# EAGLE design HD PCB Fully Integrated (EAGLE 9.6.2)
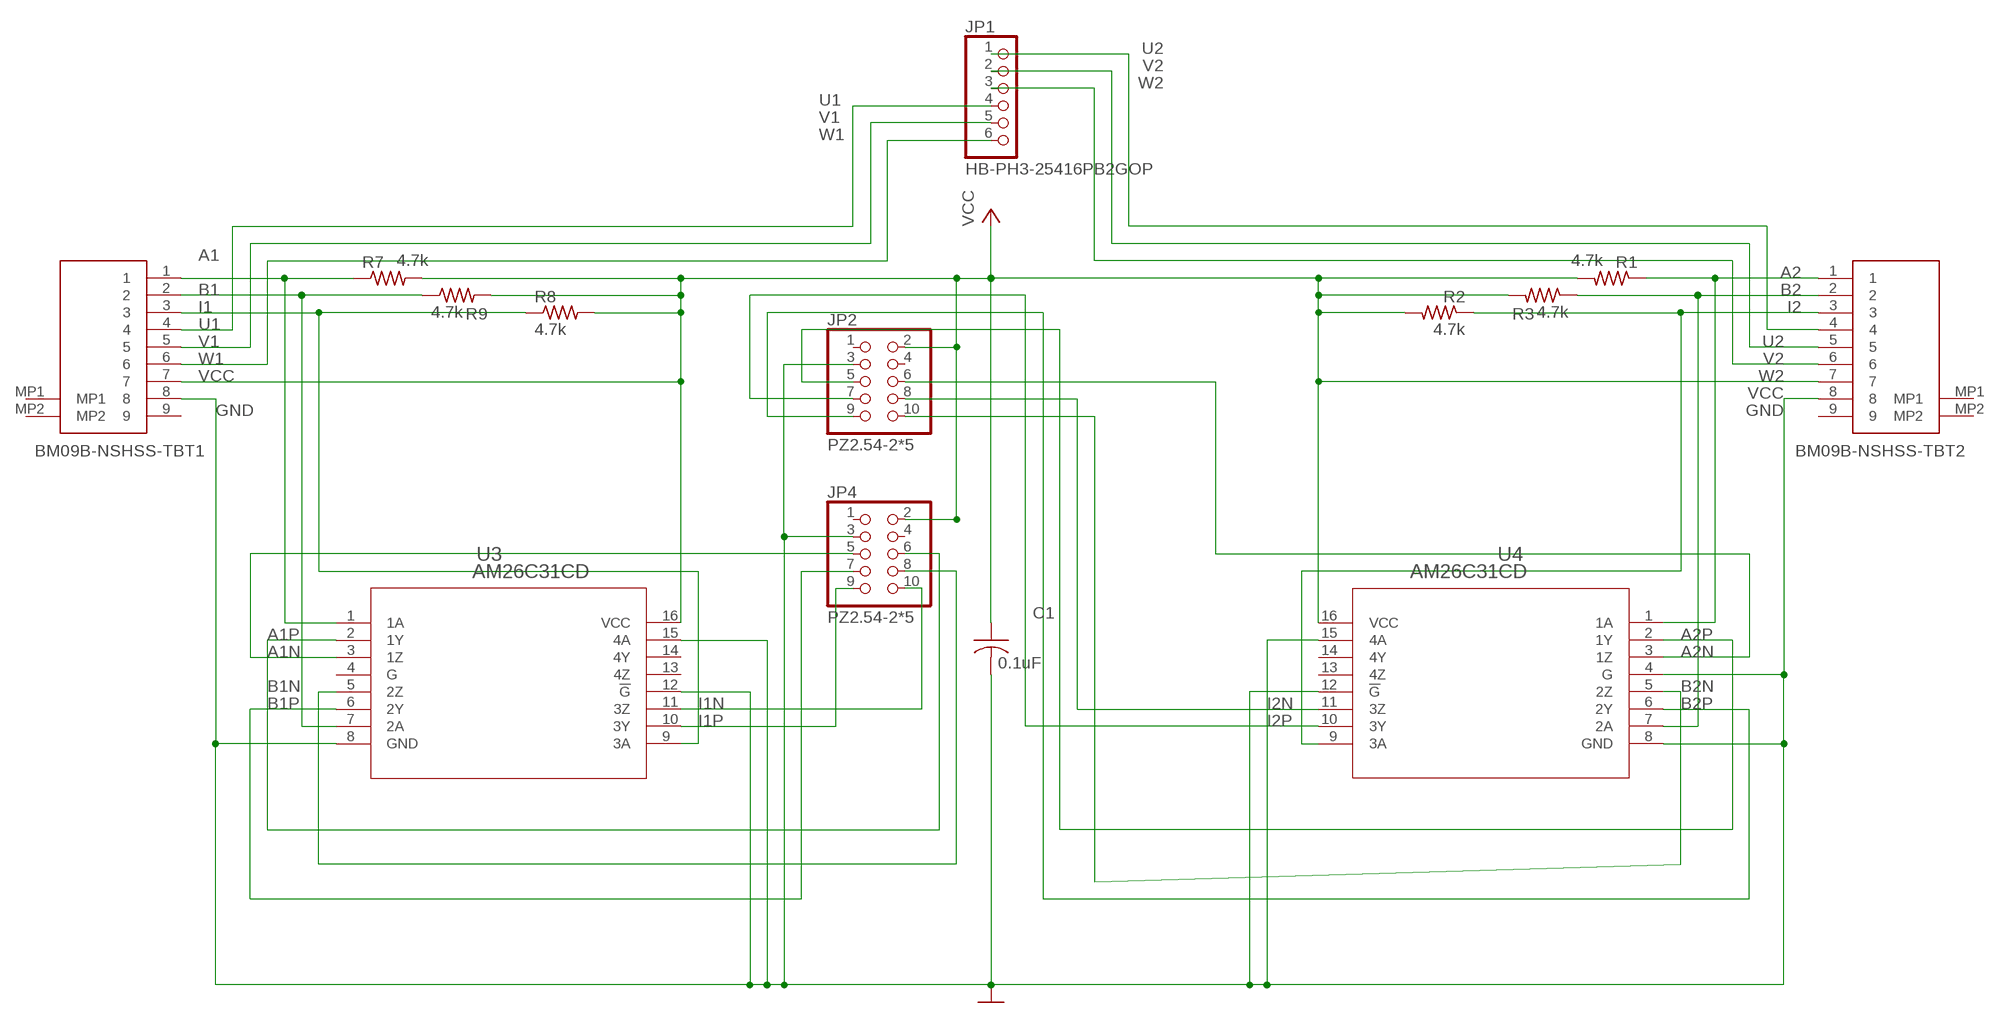
[diagram p0: schematic, sheet 1]

## Parts
BM09B-NSHSS-TBT1  BM09B-NSHSS-TBT_LF__SN_  [BM09BNSHSSTBTLFSN]
BM09B-NSHSS-TBT2  BM09B-NSHSS-TBT_LF__SN_  [BM09BNSHSSTBTLFSN]
C1  0.1uF  C-USC0805  [C0805]
JP1  HB-PH3-25416PB2GOP  PINHD-1X6  [1X06]
JP2  PZ2.54-2*5  PINHD-2X5  [2X05]
JP4  PZ2.54-2*5  PINHD-2X5  [2X05]
R1  4.7k  R-US_R0805  [R0805]
R2  4.7k  R-US_R0805  [R0805]
R3  4.7k  R-US_R0805  [R0805]
R7  4.7k  R-US_R0805  [R0805]
R8  4.7k  R-US_R0805  [R0805]
R9  4.7k  R-US_R0805  [R0805]
U3  AM26C31CD  [D16]
U4  AM26C31CD  [D16]

## Nets
A1: BM09B-NSHSS-TBT1.1 R7.1 U3.1(1A)
A1N: JP4.5 U3.3(1Z)
A1P: JP4.6 U3.2(1Y)
A2: BM09B-NSHSS-TBT2.1 R1.1 U4.1(1A)
A2N: JP2.6 U4.3(1Z)
A2P: JP2.5 U4.2(1Y)
B1: BM09B-NSHSS-TBT1.2 R9.1 U3.7(2A)
B1N: JP4.8 U3.5(2Z)
B1P: JP4.7 U3.6(2Y)
B2: BM09B-NSHSS-TBT2.2 R3.1 U4.7(2A)
B2N: JP2.10 U4.5(2Z)
B2P: JP2.9 U4.6(2Y)
GND: BM09B-NSHSS-TBT1.8 BM09B-NSHSS-TBT2.8 C1.2 JP2.3 JP4.3 U3.8(GND) U3.12(!G) U3.15(4A) U4.4(G) U4.8(GND) U4.12(!G) U4.15(4A)
I1: BM09B-NSHSS-TBT1.3 R8.1 U3.9(3A)
I1N: JP4.10 U3.11(3Z)
I1P: JP4.9 U3.10(3Y)
I2: BM09B-NSHSS-TBT2.3 R2.1 U4.9(3A)
I2N: JP2.8 U4.11(3Z)
I2P: JP2.7 U4.10(3Y)
U1: BM09B-NSHSS-TBT1.4 JP1.4
U2: BM09B-NSHSS-TBT2.4 JP1.1
V1: BM09B-NSHSS-TBT1.5 JP1.5
V2: BM09B-NSHSS-TBT2.5 JP1.2
VCC: BM09B-NSHSS-TBT1.7 BM09B-NSHSS-TBT2.7 C1.1 JP2.2 JP4.2 R1.2 R2.2 R3.2 R7.2 R8.2 R9.2 U3.16(VCC) U4.16(VCC)
W1: BM09B-NSHSS-TBT1.6 JP1.6
W2: BM09B-NSHSS-TBT2.6 JP1.3
Unconnected: BM09B-NSHSS-TBT1.9 BM09B-NSHSS-TBT1.MP1 BM09B-NSHSS-TBT1.MP2 BM09B-NSHSS-TBT2.9 BM09B-NSHSS-TBT2.MP1 BM09B-NSHSS-TBT2.MP2 JP2.1 JP2.4 JP4.1 JP4.4 U3.4(G) U3.13(4Z) U3.14(4Y) U4.13(4Z) U4.14(4Y)

## Library data of the parts
BM09B-NSHSS-TBT1 BM09B-NSHSS-TBT2 = BM09B-NSHSS-TBT_LF__SN_:BM09B-NSHSS-TBT_LF__SN_: CONN HEADER SMD 9POS 1MM Source: Datasheet <http://www.jst-mfg.com/product/pdf/eng/eNSH.pdf>; DESCRIPTION: CONN HEADER SMD 9POS 1MM; HEIGHT: 6mm; MANUFACTURER_NAME: JST (JAPAN SOLDERLESS TERMINALS); MANUFACTURER_PART_NUMBER: BM09B-NSHSS-TBT(LF)(SN)
C1 = rcl:C-US: CAPACITOR, American symbol; SPICEPREFIX: C
JP1 = pinhead:PINHD-1X6: PIN HEADER
JP2 JP4 = pinhead:PINHD-2X5: PIN HEADER
R1-R3 R7-R9 = rcl:R-US_: RESISTOR, American symbol; MF: VISHAY; MPN: CRCW04024K70FKED; OC_NEWARK: 42K3486; SPICEPREFIX: R
U3 U4 = AM26C31CD:AM26C31CD; COPYRIGHT: Copyright (C) 2023 Ultra Librarian. All rights reserved.; MANUFACTURER_PART_NUMBER: AM26C31CD; MFR_NAME: Texas Instruments

## Module HDPINOUT
Ports: GND(io) I(io) A(io) +5V(io) B(io)

### Library data of the parts

## Board
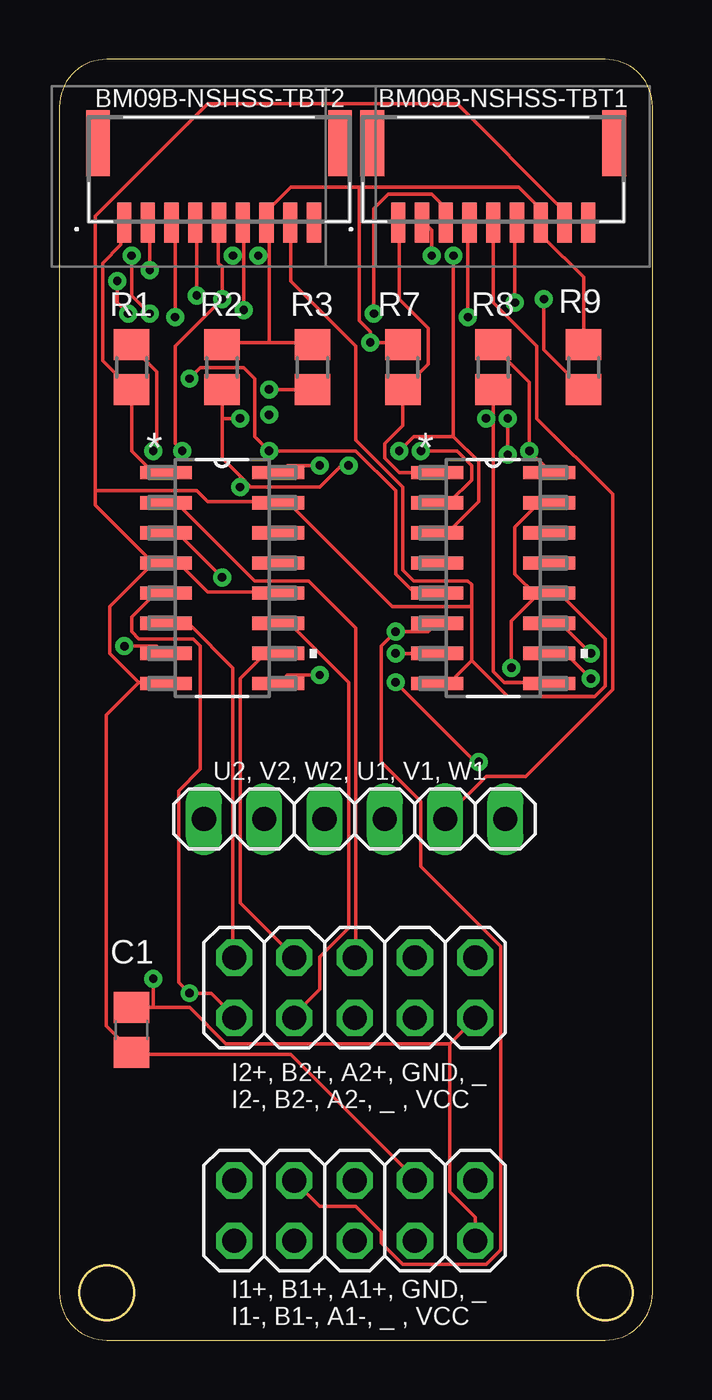
[diagram p1: board, top side]
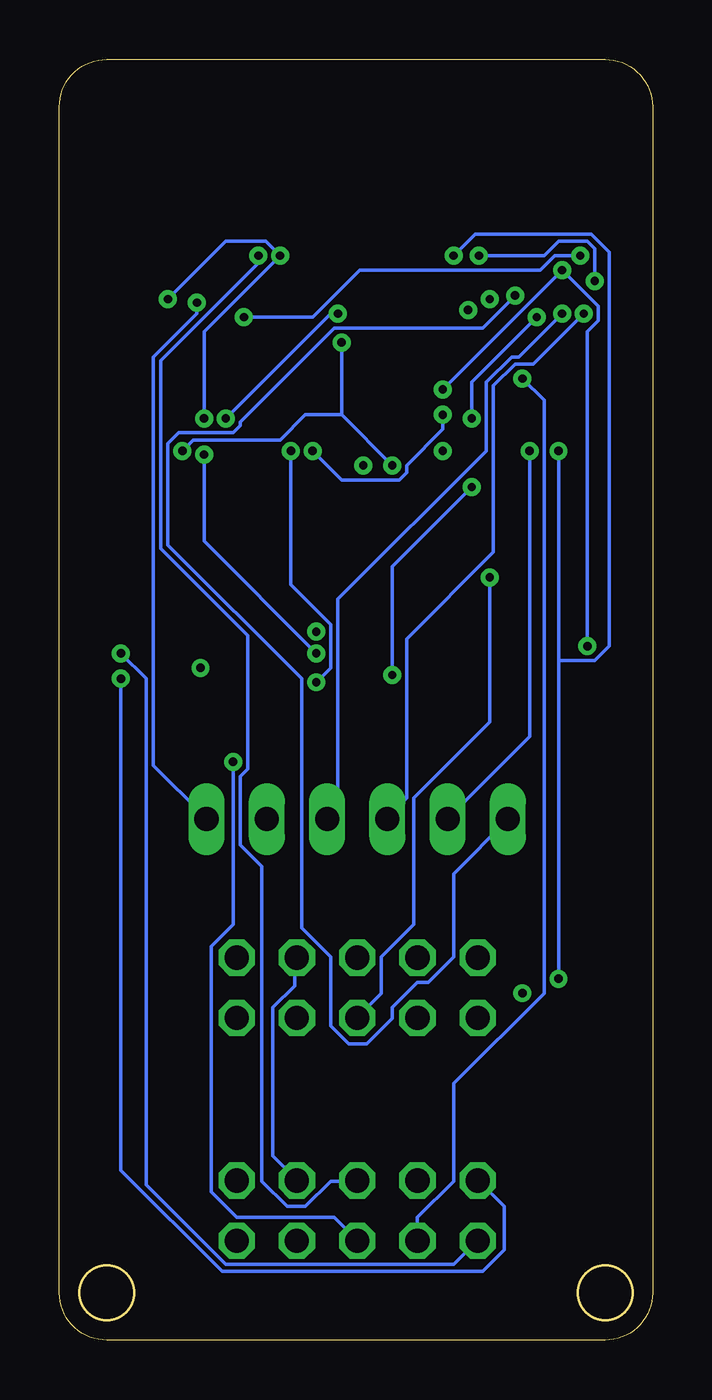
[diagram p2: board, bottom side, seen from below]

Size 25 x 54 mm. Coordinates in mm from the lower left corner, seen from the top.
Outline: 0,52 0,2 arc90 2,0 23,0 23.17,0.01 arc85 25,2 25,52 24.99,52.17 arc85 23,54 2,54 1.83,53.99 arc85 0,52
Outline: circle at 23,2 radius 1.15
Outline: circle at 2,2 radius 1.15
Copper layers (1*16): Top 0.035mm / dielectric 1.5mm / Bottom 0.035mm
Design rules "default": minimum track width 6mil, minimum drill 0.35mm, track to track 6mil, track to pad 6mil, pad to pad 6mil, via to via 6mil, smd to smd 6mil, copper to edge 40mil, drill to drill 6mil, minimum pad ring 10mil, minimum via ring 8mil, stop-mask expansion 4mil, vias tented up to drill 0mil, thermal gap 10mil

### Footprints (pad centres in the part's own frame; a part is rotated, then mirrored left to right if it is on the bottom)
BM09BNSHSSTBTLFSN = smd 0.6 x 1.7: 1 4,4.45; 2 3,4.45; 3 2,4.45; 4 1,4.45; 5 0,4.45; 6 -1,4.45; 7 -2,4.45; 8 -3,4.45; 9 -4,4.45 | smd 1 x 2.8: MP1 5.1,1.1; MP2 -5.1,1.1
C0805 = smd 1.3 x 1.5: 1 -0.95,0; 2 0.95,0
1X06 = drill 1.016 long: 1 -6.35,0; 2 -3.81,0; 3 -1.27,0; 4 1.27,0; 5 3.81,0; 6 6.35,0
2X05 = drill 1.016 octagon: 1 -5.08,-1.27; 2 -5.08,1.27; 3 -2.54,-1.27; 4 -2.54,1.27; 5 0,-1.27; 6 0,1.27; 7 2.54,-1.27; 8 2.54,1.27; 9 5.08,-1.27; 10 5.08,1.27
R0805 = smd 1.3 x 1.5: 1 -0.95,0; 2 0.95,0
D16 = smd 2.184 x 0.559: 1 -2.362,4.445; 2 -2.362,3.175; 3 -2.362,1.905; 4 -2.362,0.635; 5 -2.362,-0.635; 6 -2.362,-1.905; 7 -2.362,-3.175; 8 -2.362,-4.445; 9 2.362,-4.445; 10 2.362,-3.175; 11 2.362,-1.905; 12 2.362,-0.635; 13 2.362,0.635; 14 2.362,1.905; 15 2.362,3.175; 16 2.362,4.445

### Placement (x,y rotation side)
BM09B-NSHSS-TBT1  18.29,51.56 180 top
BM09B-NSHSS-TBT2  6.73,51.56 180 top
C1  3.05,13.08 270 top
JP1  12.45,21.97 0 top
JP2  12.45,14.86 180 top
JP4  12.45,5.46 180 top
R1  3.05,41.02 90 top
R2  6.86,41.02 90 top
R3  10.67,41.02 90 top
R7  14.48,41.02 90 top
R8  18.29,41.02 90 top
R9  22.1,41.02 90 top
U3  18.29,32.13 0 top
U4  6.86,32.13 0 top

### Tracks (layer width: path | path; a pad name or v marks a point on that pad's centre or on a via)
A1
  Top 0.152: U3.1 14.33,36.58 13.72,37.19 13.72,37.8 14.48,38.56 R7.1 14.48,40.08 15.54,41.15 15.54,42.67 14.33,43.89 14.33,47.09 BM09B-NSHSS-TBT1.1
A1N  (via drill 0.35)
  Top 0.152: v14.33,37.49 14.94,38.1 16.61,38.1 | 16.61,38.1 17.68,37.03 17.68,35.36 16.46,34.14 16,34.14 U3.3 | 16.61,38.1 v16.61,45.72
  Bottom 0.152: v8.84,39.01 8.84,38.41 10.36,36.88 10.36,36.58 10.67,36.27 13.11,36.27 v14.33,37.49 | v16.61,45.72 16.61,45.41 20.73,41.3 20.73,33.38 17.07,29.72 17.07,24.08 17.37,23.77 17.37,20.88 16.46,19.96 16.46,6.71 15.39,5.64 14.63,5.64 13.56,6.71 12.5,6.71 JP4.5
A1P  (via drill 0.35)
  Top 0.152: v15.24,37.49 16.76,37.49 17.37,36.88 17.37,36.27 16.46,35.36 16,35.36 U3.2 | v14.17,27.74 17.53,24.38 v17.68,24.38
  Bottom 0.152: v17.68,24.38 17.68,17.53 18.59,16.61 18.59,6.25 17.53,5.18 13.41,5.18 12.5,4.27 JP4.6 | v15.24,37.49 15.24,31.85 13.56,30.18 13.56,28.35 v14.17,27.74
A2
  Top 0.152: U4.1 3.96,36.58 3.05,37.49 R1.1 3.05,40.08 1.83,41.3 1.83,45.41 2.59,46.18 2.59,47.09 BM09B-NSHSS-TBT2.1
A2N  (via drill 0.35)
  Top 0.152: v6.86,32.16 5.03,33.98 4.57,33.98 U4.3
  Bottom 0.152: v6.86,32.16 6.86,26.06 10.06,22.86 10.06,17.53 11.43,16.15 11.43,14.63 12.34,13.72 JP2.6
A2P
  Top 0.152: U4.2 4.57,35.2 5.03,35.2 8.23,32 10.52,32 12.5,30.02 12.5,16.15 JP2.5
B1  (via drill 0.35)
  Top 0.152: v15.7,45.72 15.7,46.79 15.39,47.09 BM09B-NSHSS-TBT1.2 | v20.42,43.89 20.42,41.76 22.1,40.08 R9.1 | v14.17,28.96 U3.7 | v18.9,38.86 v18.9,37.34
  Bottom 0.152: v20.42,43.89 17.98,46.33 16.31,46.33 v15.7,45.72 18.9,42.52 v18.9,38.86 | v14.17,28.96 18.9,33.68 v18.9,37.34
B1N  (via drill 0.35)
  Top 0.152: U3.5 15.85,31.55 14.94,31.55 14.17,32.31 14.17,35.81 12.5,37.49 v8.84,37.49 8.23,38.1 8.23,40.54 7.77,41 5.94,41 v5.49,40.54
  Bottom 0.152: JP4.8 9.91,5.18 8.38,6.71 8.38,10.82 4.57,14.63 4.57,39.62 v5.49,40.54
B1P  (via drill 0.35)
  Top 0.152: U3.6 15.85,30.18 15.54,29.87 v14.17,29.87 13.56,29.26 13.56,24.38 15.24,22.71 15.24,19.96 18.59,16.61 18.59,3.81 17.98,3.2 14.48,3.2 13.56,4.12 13.56,4.57 12.5,5.64 10.97,5.64 9.91,6.71 JP4.7
B2  (via drill 0.35)
  Top 0.152: v2.74,29.26 4.12,29.26 4.42,28.96 U4.7 | v8.84,40.08 10.67,40.08 R3.1 | v3.81,45.11 3.81,47.09 BM09B-NSHSS-TBT2.2
  Bottom 0.152: v8.84,40.08 v3.81,45.11 2.29,43.59 2.29,42.98 2.74,42.52 v2.74,29.26
B2N  (via drill 0.35)
  Top 0.152: JP2.10 7.32,13.72 6.4,14.63 v5.49,14.63 5.03,15.09 5.03,23.16 5.94,24.08 5.94,29.26 5.64,29.57 3.35,29.57 3.05,29.87 3.05,30.48 3.96,31.39 4.42,31.39 U4.5
B2P
  Top 0.152: U4.6 4.57,30.18 5.49,30.18 7.32,28.35 7.32,16.15 JP2.9
GND  (via drill 0.35)
  Top 0.152: v19.05,28.35 19.05,30.33 20.12,31.39 | 20.12,31.39 20.57,31.39 U3.12 | 20.12,31.39 19.2,32.31 19.2,34.29 20.12,35.2 20.57,35.2 U3.15 | 20.12,31.39 U3.12 | 17.37,28.65 17.37,30.94 | 17.37,30.94 17.37,31.85 17.22,32 14.94,32 14.48,32.46 14.48,35.97 12.5,37.95 12.5,41.91 9.75,44.65 9.75,47.09 BM09B-NSHSS-TBT2.8 | 17.37,28.65 16.46,27.74 16,27.74 U3.8 | 17.37,28.65 18.9,27.13 22.55,27.13 23.01,27.58 23.01,29.57 21.18,31.39 20.73,31.39 U3.12 | JP4.3 14.94,6.86 9.75,12.04 3.05,12.04 C1.2 3.05,12.19 1.98,13.26 1.98,26.36 3.35,27.74 | 1.52,35.81 1.52,35.2 3.96,32.77 | 1.52,35.81 1.52,47.4 6.25,52.12 16.76,52.12 21.18,47.7 21.18,47.24 BM09B-NSHSS-TBT1.8 | U4.4 3.96,32.77 | 3.35,27.74 4.42,27.74 U4.8 | 3.35,27.74 2.13,28.96 2.13,30.94 3.96,32.77 | 4.42,32.77 U4.4 | U4.4 5.03,32.77 6.25,31.55 9.14,31.55 U4.12 | 1.52,35.81 5.79,35.81 6.25,35.36 9.14,35.36 U4.15 9.3,35.2 9.75,35.2 14.02,30.94 17.37,30.94
  Bottom 0.152: JP2.3 15.09,16 15.09,14.94 16,14.02 16,7.77 15.09,6.86 JP4.3
I1  (via drill 0.35)
  Top 0.152: 18.29,38.86 18.29,28.19 18.75,27.74 20.57,27.74 U3.9 | 18.29,38.86 R8.1 | v13.26,43.28 13.26,47.7 13.87,48.31 15.7,48.31 16.15,47.85 16.15,47.24 BM09B-NSHSS-TBT1.3 | 18.29,38.86 v17.98,38.86
  Bottom 0.152: v13.26,43.28 13.56,43.28 v17.98,38.86
I1N  (via drill 0.35)
  Top 0.152: v22.4,28.96 21.18,30.18 20.73,30.18 U3.11
  Bottom 0.152: v22.4,28.96 21.34,27.89 21.34,6.55 17.98,3.2 8.38,3.2 7.47,4.12 JP4.10
I1P  (via drill 0.35)
  Top 0.152: v22.4,27.89 21.34,28.96 U3.10
  Bottom 0.152: v22.4,27.89 22.4,7.16 18.14,2.9 7.16,2.9 6.25,3.81 6.25,5.64 7.32,6.71 JP4.9
I2  (via drill 0.35)
  Top 0.152: v10.97,28.04 9.6,28.04 9.3,27.74 U4.9 | v12.19,36.88 11.89,36.88 10.97,35.97 8.08,35.97 7.62,36.42 | 7.62,36.42 6.86,37.19 6.86,38.86 | R2.1 6.86,38.86 | v4.88,43.13 4.88,47.09 BM09B-NSHSS-TBT2.3 | 6.86,38.86 v7.62,38.86 | 7.62,36.42 v7.62,35.97
  Bottom 0.152: v4.88,43.13 7.62,40.39 v7.62,38.86 | v10.97,28.04 10.97,32.61 v7.62,35.97
I2N
  Top 0.152: U4.11 9.3,30.18 9.75,30.18 12.19,27.74 12.19,17.37 10.97,16.15 10.97,14.78 9.91,13.72 JP2.8
I2P
  Top 0.152: U4.10 8.69,28.96 7.62,27.89 7.62,18.44 9.91,16.15 JP2.7
U1  (via drill 0.35)
  Top 0.152: v17.22,43.13 17.22,47.09 BM09B-NSHSS-TBT1.4 | v3.05,45.72 3.05,44.04 v3.81,43.28
  Bottom 0.152: v17.22,43.13 14.33,43.13 12.34,45.11 4.72,45.11 4.12,45.72 v3.05,45.72 | v3.81,43.28 5.64,41.45 5.94,41.45 7.01,40.39 7.01,37.49 13.26,31.24 13.26,22.55 13.72,22.1 JP1.4
U2  (via drill 0.35)
  Top 0.152: v5.79,44.04 5.79,47.09 BM09B-NSHSS-TBT2.4
  Bottom 0.152: v5.79,44.04 7.16,42.67 13.41,42.67 17.37,38.71 17.37,38.56 17.68,38.25 19.96,38.25 20.42,37.8 20.42,33.53 14.78,27.89 14.78,17.37 13.56,16.15 13.56,13.26 12.8,12.5 12.04,12.5 10.97,13.56 10.97,14.02 9.91,15.09 9.45,15.09 8.38,16.15 8.38,19.66 6.1,21.95 JP1.1
V1
  Top 0.152: BM09B-NSHSS-TBT1.5 18.29,43.74 20.12,41.91 20.12,38.86 23.32,35.66 23.32,27.43 19.66,23.77 17.98,23.77 16.31,22.1 JP1.5
V2  (via drill 0.35)
  Top 0.152: BM09B-NSHSS-TBT2.5 6.71,47.09 6.71,45.41 6.86,45.26 v6.86,43.89 4.88,41.91 4.88,37.8 v5.18,37.49
  Bottom 0.152: v5.18,37.49 5.18,25.45 8.53,22.1 JP1.2
VCC  (via drill 0.35)
  Top 0.152: U3.16 20.73,36.58 v19.81,37.49 19.81,40.39 18.29,41.91 R8.2 | R7.2 14.48,42.06 v13.11,42.06 13.11,42.52 12.65,42.98 12.65,48.62 | v10.97,36.88 9.6,36.88 9.3,36.58 U4.16 | R9.2 22.1,44.81 20.42,46.48 20.42,47.09 BM09B-NSHSS-TBT1.7 20.27,47.24 20.27,47.7 19.36,48.62 12.65,48.62 | 8.84,42.06 10.67,42.06 R3.2 | 8.84,42.06 6.86,42.06 R2.2 | 8.84,42.06 8.84,45.72 | 8.84,45.72 8.84,47.09 BM09B-NSHSS-TBT2.7 8.84,47.24 8.84,47.7 9.75,48.62 12.65,48.62 | 3.96,14.02 5.49,14.02 7.01,12.5 16.46,12.5 | 3.96,14.02 C1.1 | 16.46,12.5 17.53,13.56 JP2.2 | v3.96,37.49 4.12,37.64 4.12,40.84 3.05,41.91 R1.2 | 3.96,14.02 v3.96,15.24 | JP4.2 17.53,5.18 16.46,6.25 16.46,12.5 | v8.38,45.72 8.84,45.72
  Bottom 0.152: 13.11,39.01 v13.11,42.06 | v10.97,36.88 13.11,39.01 | v19.81,37.49 19.36,37.95 15.7,37.95 14.63,39.01 13.11,39.01 | v3.96,15.24 3.96,28.65 | 3.96,28.65 v3.96,37.49 | v8.38,45.72 7.47,46.63 2.59,46.63 1.83,45.87 1.83,29.26 2.44,28.65 3.96,28.65
W1  (via drill 0.35)
  Top 0.152: v19.2,43.74 19.2,47.09 BM09B-NSHSS-TBT1.6
  Bottom 0.152: v19.2,43.74 19.2,43.28 21.03,41.45 21.03,24.23 18.9,22.1 JP1.6
W2  (via drill 0.35)
  Top 0.152: 7.77,45.72 7.77,47.09 BM09B-NSHSS-TBT2.6 | 7.77,45.72 v7.77,43.43 | v7.32,45.72 7.77,45.72 | v2.44,44.65 2.44,43.74 v2.9,43.28
  Bottom 0.152: v7.32,45.72 4.57,45.72 3.96,46.33 2.74,46.33 2.44,46.02 v2.44,44.65 | v2.9,43.28 5.03,41.15 5.79,41.15 6.71,40.23 6.71,33.22 10.36,29.57 10.36,22.86 11.12,22.1 JP1.3

### Text on the board
_tNames: U2, V2, W2, U1, V1, W1 | I2+, B2+, A2+, GND, _ / I2-, B2-, A2-, _ , VCC | I1+, B1+, A1+, GND, _ / I1-, B1-, A1-, _ , VCC